# EAGLE design Carte_moteur (EAGLE 6.4)
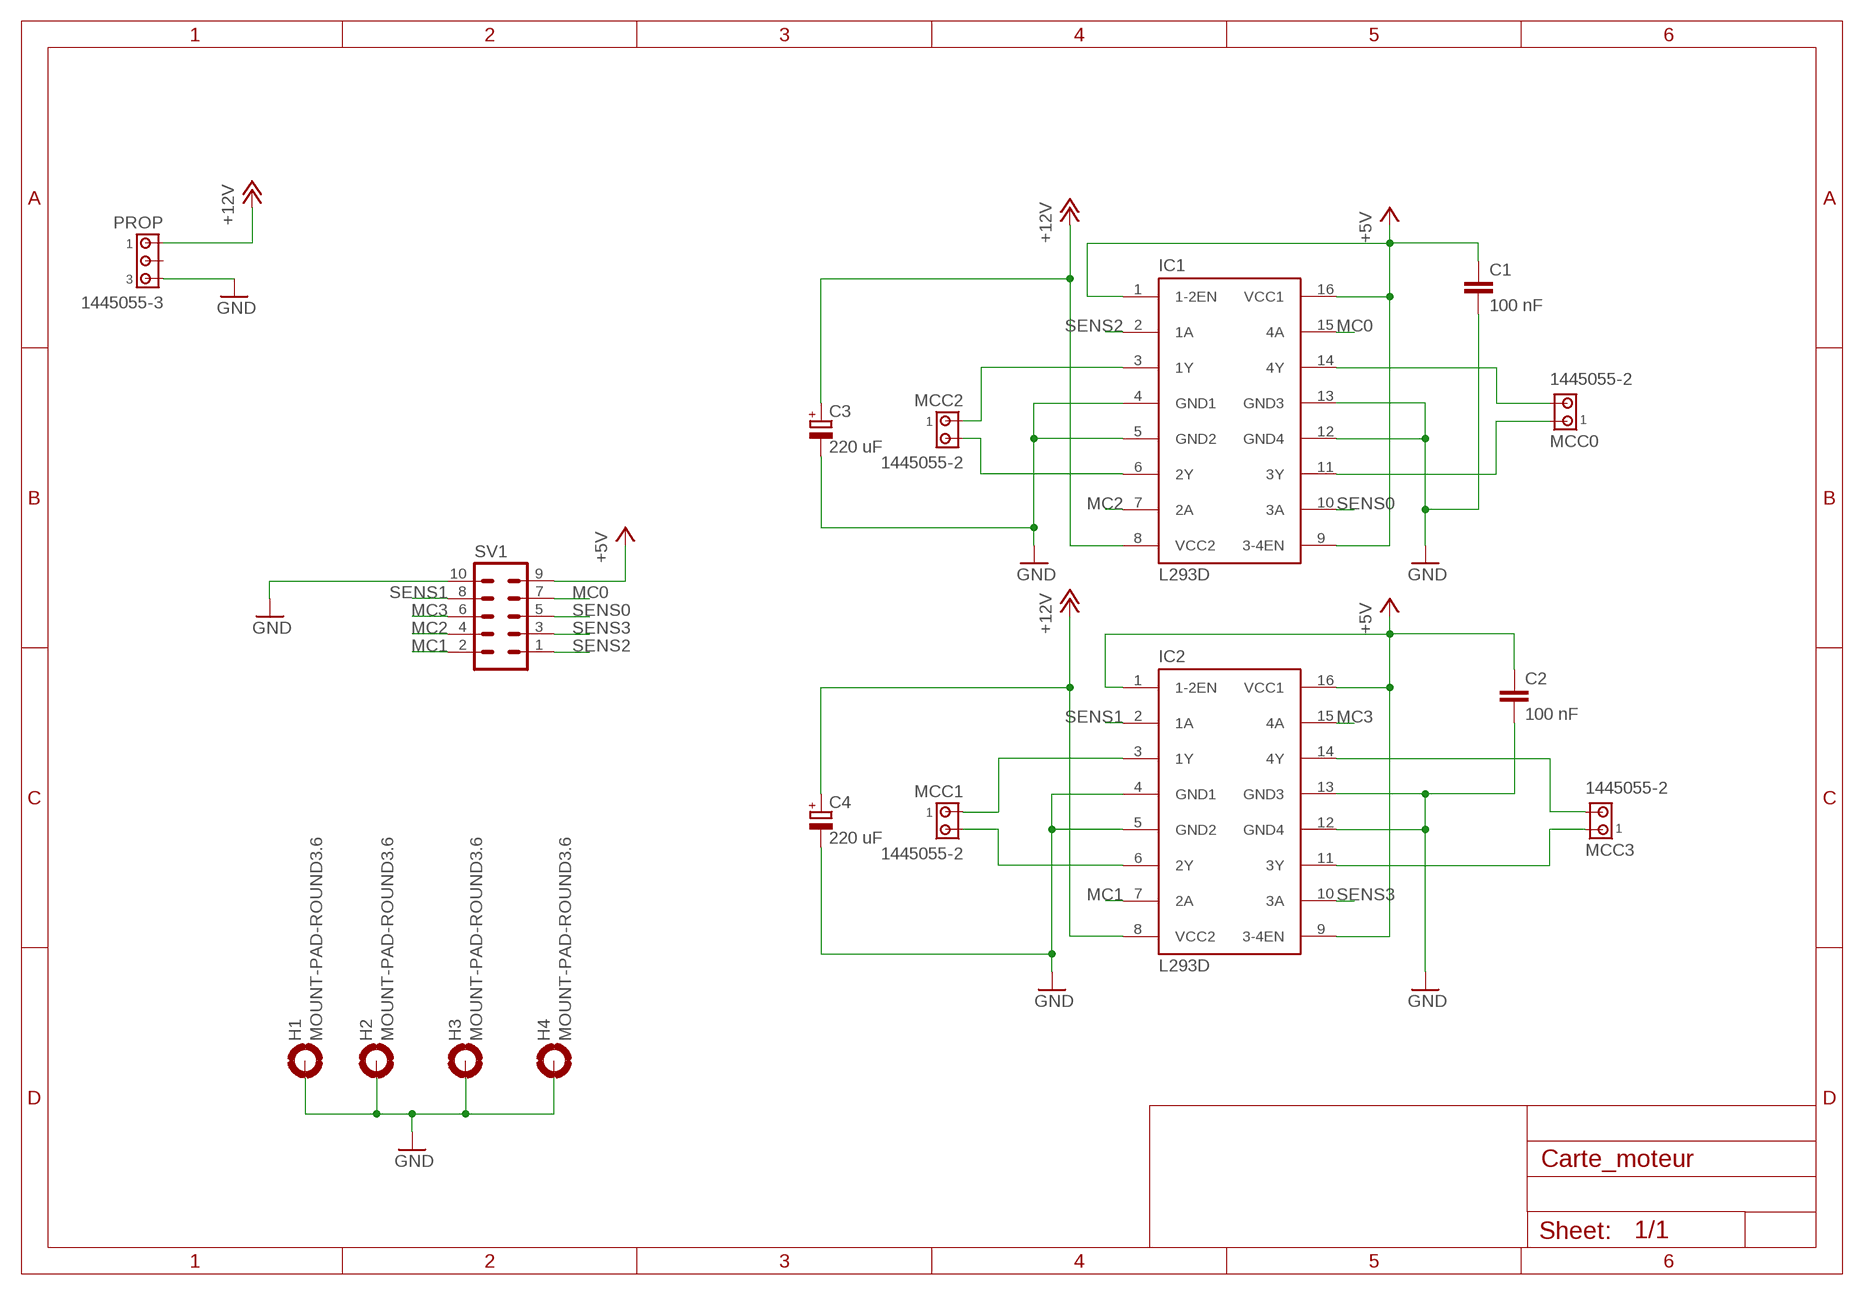
[diagram p0: schematic, sheet 1]

## Parts
C1  100 nF  C-EUC0805  [C0805]
C2  100 nF  C-EUC0805  [C0805]
C3  220 uF  CPOL-EUG  [PANASONIC_G]
C4  220 uF  CPOL-EUG  [PANASONIC_G]
H1  MOUNT-PAD-ROUND3.6  [3,6-PAD]
H2  MOUNT-PAD-ROUND3.6  [3,6-PAD]
H3  MOUNT-PAD-ROUND3.6  [3,6-PAD]
H4  MOUNT-PAD-ROUND3.6  [3,6-PAD]
IC1  L293D  [DIL16]
IC2  L293D  [DIL16]
MCC0  1445055-2  [1445055-2]
MCC1  1445055-2  [1445055-2]
MCC2  1445055-2  [1445055-2]
MCC3  1445055-2  [1445055-2]
PROP  1445055-3  [1445055-3]
SV1  ML10  [ML10]

## Nets
+5V: C1.1 C2.1 IC1.1(1-2EN) IC1.9(3-4EN) IC1.16(VCC1) IC2.1(1-2EN) IC2.9(3-4EN) IC2.16(VCC1) SV1.9
+12V: C3.+ C4.+ IC1.8(VCC2) IC2.8(VCC2) PROP.1
GND: C1.2 C2.2 C3.- C4.- H1.B3,6(MOUNT) H2.B3,6(MOUNT) H3.B3,6(MOUNT) H4.B3,6(MOUNT) IC1.4(GND1) IC1.5(GND2) IC1.12(GND4) IC1.13(GND3) IC2.4(GND1) IC2.5(GND2) IC2.12(GND4) IC2.13(GND3) PROP.3 SV1.10
MC0: IC1.15(4A) SV1.7
MC1: IC2.7(2A) SV1.2
MC2: IC1.7(2A) SV1.4
MC3: IC2.15(4A) SV1.6
N$1: IC1.3(1Y) MCC2.1
N$2: IC1.6(2Y) MCC2.2
N$3: IC1.14(4Y) MCC0.2
N$4: IC1.11(3Y) MCC0.1
N$5: IC2.3(1Y) MCC1.1
N$6: IC2.6(2Y) MCC1.2
N$7: IC2.11(3Y) MCC3.1
N$8: IC2.14(4Y) MCC3.2
SENS0: IC1.10(3A) SV1.5
SENS1: IC2.2(1A) SV1.8
SENS2: IC1.2(1A) SV1.1
SENS3: IC2.10(3A) SV1.3
Unconnected: PROP.2

## Library data of the parts
C1 C2 = rcl:C-EU: CAPACITOR, European symbol
C3 C4 = rcl:CPOL-EU: POLARIZED CAPACITOR, European symbol
H1-H4 = holes:MOUNT-PAD-ROUND: MOUNTING PAD, round
IC1 IC2 = st-microelectronics:L293D: PUSH-PULL 4 CHANNEL DRIVER; MPN: L293D; OC_FARNELL: 9589619; OC_NEWARK: 56P8249
MCC0 MCC1-MCC3 = con-amp:1445055-2: Micro MATE-N-LOK Connectors grid 1.5 mm Source: ENG_CD_1445055_A.pdf
PROP = con-amp:1445055-3: Micro MATE-N-LOK Connectors grid 1.5 mm Source: ENG_CD_1445055_A.pdf
SV1 = con-ml:ML10: HARTING; OC_FARNELL: unknown; OC_NEWARK: unknown

## Board
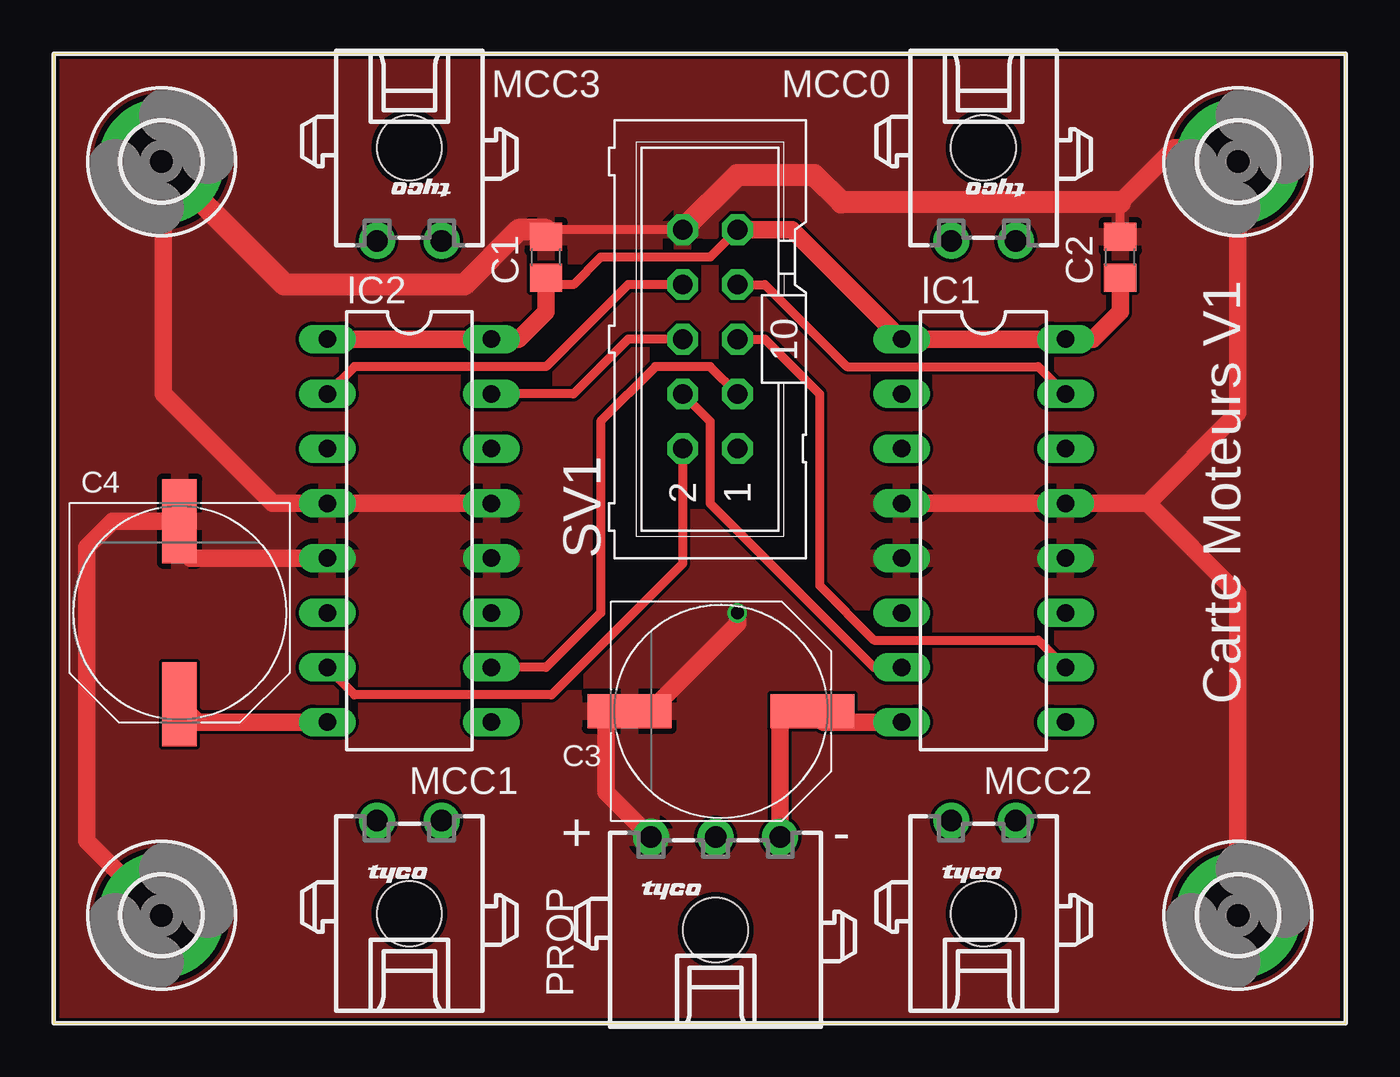
[diagram p1: board, top side]
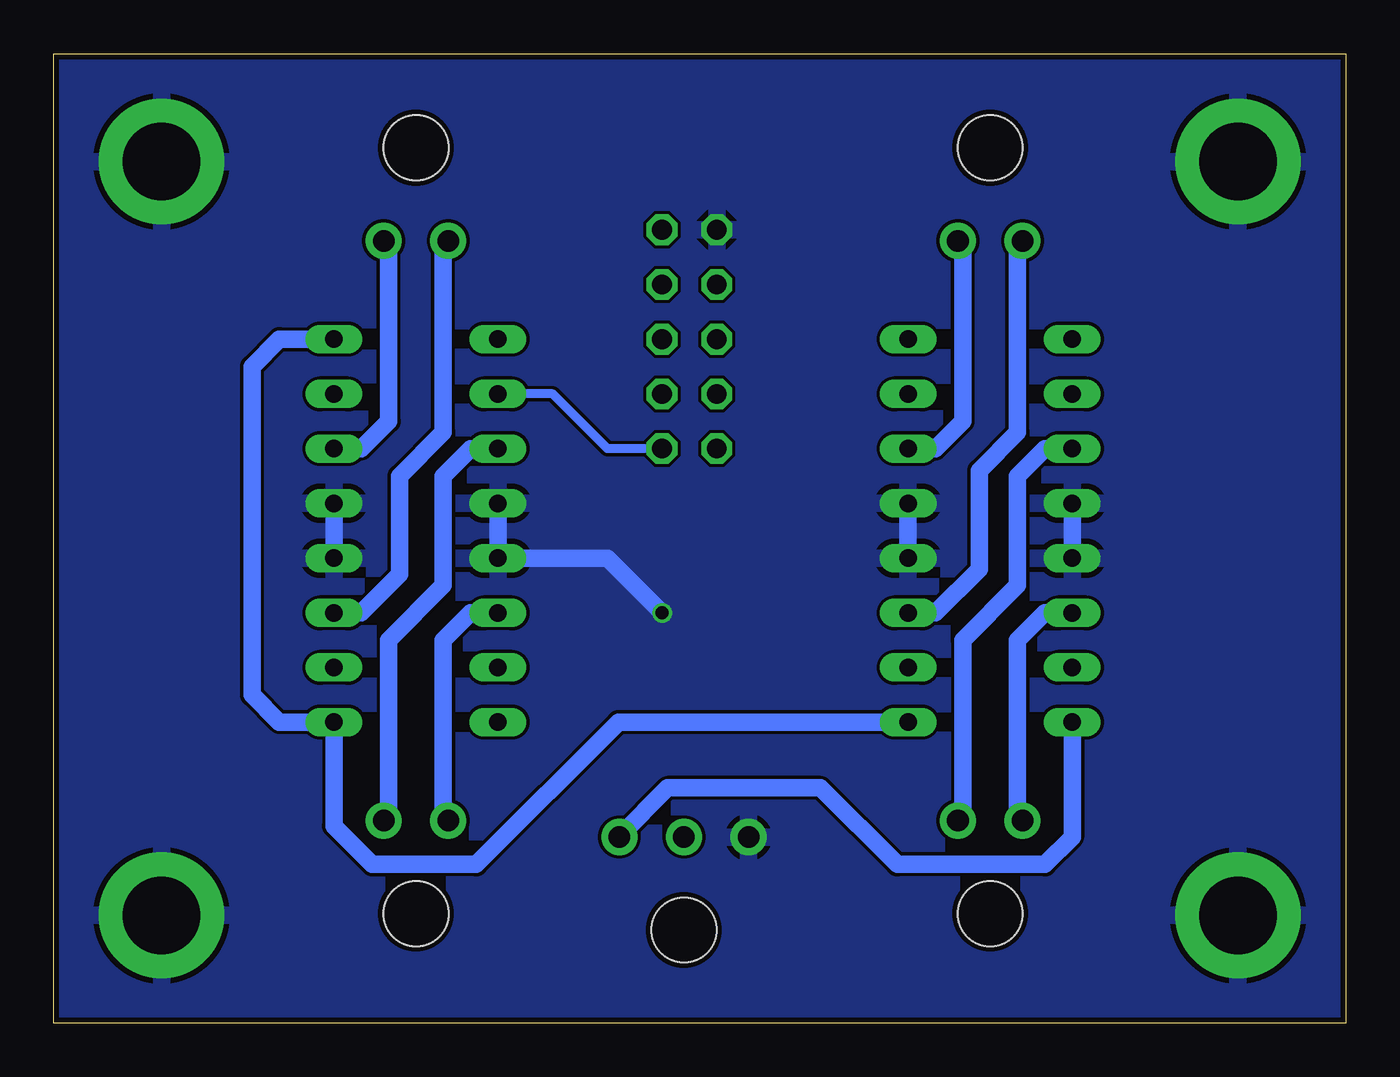
[diagram p2: board, bottom side, seen from below]

Size 60 x 45 mm. Coordinates in mm from the lower left corner, seen from the top.
Outline: 0,0 60,0 60,45 0,45 0,0
Copper layers (1*16): Top 0.035mm / dielectric 1.5mm / Bottom 0.035mm
Design rules "Fusion_eagle_rule_v1.1 *": minimum track width 6mil, minimum drill 12mil, track to track 6mil, track to pad 6mil, pad to pad 6mil, via to via 6mil, smd to smd 0mil, copper to edge 10mil, drill to drill 10mil, minimum pad ring 10mil, minimum via ring 6mil, stop-mask expansion 2mil, vias tented up to drill 100mil, thermal gap 10mil

### Footprints (pad centres in the part's own frame; a part is rotated, then mirrored left to right if it is on the bottom)
C0805 = smd 1.3 x 1.5: 1 -0.95,0; 2 0.95,0
PANASONIC_G = smd 3.9 x 1.6: + 4.25,0; - -4.25,0
3,6-PAD = drill 3.6 pad 5.842: B3,6 0,0
DIL16 = drill 0.813 long: 1 -8.89,-3.81; 2 -6.35,-3.81; 3 -3.81,-3.81; 4 -1.27,-3.81; 5 1.27,-3.81; 6 3.81,-3.81; 7 6.35,-3.81; 8 8.89,-3.81; 9 8.89,3.81; 10 6.35,3.81; 11 3.81,3.81; 12 1.27,3.81; 13 -1.27,3.81; 14 -3.81,3.81; 15 -6.35,3.81; 16 -8.89,3.81
1445055-2 = drill 1 pad 1.676: 1 1.5,4.32; 2 -1.5,4.32 | hole 3: 0,0
1445055-3 = drill 1 pad 1.676: 1 3,4.32; 2 0,4.32; 3 -3,4.32 | hole 3: 0,0
ML10 = drill 0.914 octagon: 1 -5.08,-1.27; 2 -5.08,1.27; 3 -2.54,-1.27; 4 -2.54,1.27; 5 0,-1.27; 6 0,1.27; 7 2.54,-1.27; 8 2.54,1.27; 9 5.08,-1.27; 10 5.08,1.27

### Placement (x,y rotation side)
C1  22.86,35.56 90 top
C2  49.53,35.56 90 top
C3  30.99,14.48 0 top
C4  5.84,19.05 270 top
H1  5,5 0 top
H2  5,40 0 top
H3  55,40 0 top
H4  55,5 0 top
IC1  43.18,22.86 270 top
IC2  16.51,22.86 270 top
MCC0  43.18,40.64 180 top
MCC1  16.51,5.08 0 top
MCC2  43.18,5.08 0 top
MCC3  16.51,40.64 180 top
PROP  30.73,4.32 0 top
SV1  30.48,31.75 90 top

### Tracks (layer width: path | path; a pad name or v marks a point on that pad's centre or on a via)
+5V
  Top 0.406: SV1.9 30.48,35.56 25.4,35.56 24.13,34.29 23.18,34.29 C1.1
  Top 0.813: IC2.1 IC2.16 21.59,31.75 22.86,33.02 C1.1 | C2.1 49.53,33.02 48.26,31.75 IC1.16 IC1.1 34.29,36.83 SV1.9
  Bottom 0.813: IC2.9 33.78,13.97 40.39,7.37 45.21,7.37 46.99,9.14 IC1.9 49.53,13.97 50.8,15.24 50.8,30.48 49.53,31.75 IC1.16
+12V
  Top 0.813: IC2.8 6.67,13.97 C4.+ | IC1.8 35.75,13.97 C3.+ 34.04,14.48 33.73,14.18 PROP.1
  Bottom 0.813: IC2.8 12.7,8.64 13.97,7.37 20.83,7.37 24.38,10.92 31.5,10.92 33.73,8.68 PROP.1
GND  (via drill 0.6)
  Top 0.406: SV1.10 23.18,36.83 C1.2 | C2.2 49.53,38.1
  Top 0.813: IC1.4 IC1.13 50.8,24.13 | IC2.13 IC2.4 10.16,24.13 5.08,29.21 5.08,39.92 H2.B3,6 5.64,40.64 | IC2.5 6.35,21.59 5.84,22.1 C4.- 2.73,23.3 1.52,22.1 1.52,8.48 H1.B3,6 | H4.B3,6 55,19.93 50.8,24.13 | 50.8,24.13 55,28.33 H3.B3,6 54.36,40.64 52.07,40.64 49.53,38.1 | C1.2 22.86,36.83 | v31.75,19.05 31.75,18.54 27.69,14.48 C3.- 25.65,14.48 25.65,10.72 PROP.3
  Top 1.016: 22.86,36.83 21.59,36.83 19.05,34.29 10.71,34.29 H2.B3,6 | 49.53,38.1 36.58,38.1 35.31,39.37 31.75,39.37 SV1.10
  Bottom 0.813: IC1.4 IC1.5 34.29,21.59 v31.75,19.05 | IC1.12 IC1.13 | IC2.12 IC2.13 | IC2.5 IC2.4
  pour Bottom: -12.7,49.53 -12.7,-5.08 73.66,-5.08 73.66,49.53
  pour Top: -7.62,48.26 -7.62,-2.54 68.58,-2.54 68.58,48.26
MC0
  Top 0.406: SV1.7 33.02,34.29 36.83,30.48 45.72,30.48 IC1.15
MC1
  Top 0.406: SV1.2 29.21,21.34 23.11,15.24 13.97,15.24 IC2.7
MC2
  Top 0.406: SV1.4 30.48,27.94 30.48,24.13 38.1,16.51 IC1.7
MC3
  Top 0.406: SV1.6 26.67,31.75 24.13,29.21 IC2.15
N$1
  Bottom 0.813: IC1.3 40.64,26.67 41.91,25.4 41.91,20.32 44.45,17.78 44.45,9.63 MCC2.1
N$2
  Bottom 0.813: IC1.6 40.64,19.05 41.91,17.78 41.91,9.63 MCC2.2
N$3
  Bottom 0.813: IC1.14 45.72,26.67 44.45,27.94 44.45,36.09 MCC0.2
N$4
  Bottom 0.813: IC1.11 45.72,19.05 43.94,20.83 43.94,25.4 41.91,27.43 41.91,36.09 MCC0.1
N$5
  Bottom 0.813: IC2.3 13.97,26.67 15.24,25.4 15.24,20.32 17.78,17.78 17.78,9.63 MCC1.1
N$6
  Bottom 0.813: IC2.6 13.97,19.05 15.24,17.78 15.24,9.63 MCC1.2
N$7
  Bottom 0.813: IC2.11 19.05,19.05 17.02,21.08 17.02,25.65 15.24,27.43 15.24,36.09 MCC3.1
N$8
  Bottom 0.813: IC2.14 19.05,26.67 17.78,27.94 17.78,36.09 MCC3.2
SENS0
  Top 0.406: SV1.5 33.02,31.75 35.56,29.21 35.56,20.32 38.1,17.78 45.72,17.78 IC1.10
SENS1
  Top 0.406: SV1.8 26.67,34.29 22.86,30.48 13.97,30.48 IC2.2
SENS2
  Bottom 0.406: SV1.1 34.29,26.67 36.83,29.21 IC1.2
SENS3
  Top 0.406: SV1.3 30.48,30.48 27.94,30.48 25.4,27.94 25.4,19.05 22.86,16.51 IC2.10

### Text on the board
tPlace: Carte Moteurs V1 | + | -